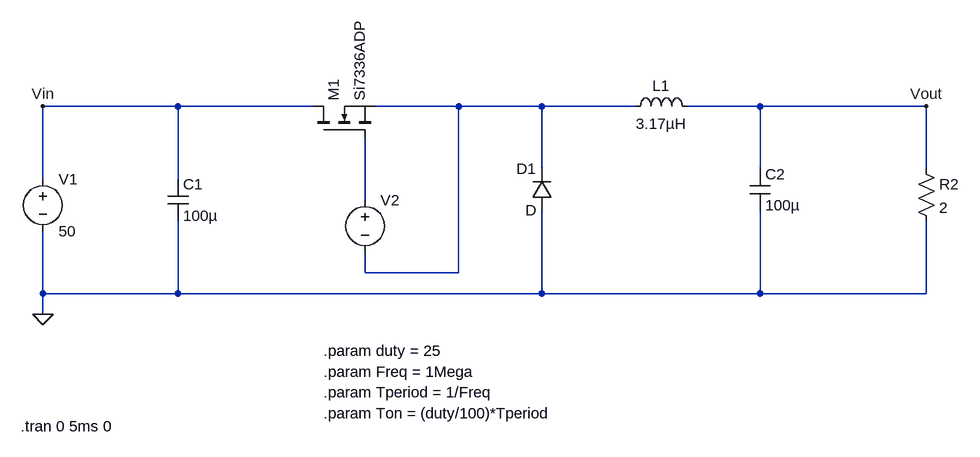
[diagram p0: schematic buck.asc]
buck.asc, the LTspice schematic file:
Version 4
SHEET 1 1432 680
WIRE -160 64 -368 64
WIRE 48 64 -160 64
WIRE 272 64 144 64
WIRE 400 64 272 64
WIRE 544 64 400 64
WIRE 736 64 624 64
WIRE 992 64 736 64
WIRE 400 160 400 64
WIRE 736 160 736 64
WIRE 992 160 992 64
WIRE -368 176 -368 64
WIRE -160 176 -160 64
WIRE 128 208 128 112
WIRE 128 320 128 288
WIRE 272 320 272 64
WIRE 272 320 128 320
WIRE -368 352 -368 256
WIRE -160 352 -160 240
WIRE -160 352 -368 352
WIRE 400 352 400 224
WIRE 400 352 -160 352
WIRE 736 352 736 224
WIRE 736 352 400 352
WIRE 992 352 992 240
WIRE 992 352 736 352
WIRE -368 384 -368 352
FLAG -368 384 0
FLAG 992 64 Vout
FLAG -368 64 Vin
SYMBOL voltage -368 160 R0
SYMATTR InstName V1
SYMATTR Value 50
SYMBOL cap -176 176 R0
SYMATTR InstName C1
SYMATTR Value 100µ
SYMBOL nmos 48 112 R270
SYMATTR InstName M1
SYMATTR Value Si7336ADP
SYMBOL voltage 128 192 R0
WINDOW 3 24 96 Invisible 2
WINDOW 123 0 0 Left 0
WINDOW 39 0 0 Left 0
SYMATTR InstName V2
SYMATTR Value PULSE(0 5 0 0 0 {Ton} {Tperiod})
SYMBOL ind 528 80 R270
WINDOW 0 32 56 VTop 2
WINDOW 3 5 56 VBottom 2
SYMATTR InstName L1
SYMATTR Value 3.17µH
SYMBOL cap 720 160 R0
SYMATTR InstName C2
SYMATTR Value 100µ
SYMBOL res 976 144 R0
SYMATTR InstName R2
SYMATTR Value 2
SYMBOL diode 416 224 R180
WINDOW 0 24 64 Left 2
WINDOW 3 24 0 Left 2
SYMATTR InstName D1
TEXT 64 536 Left 2 !.param Ton = (duty/100)*Tperiod
TEXT 64 504 Left 2 !.param Tperiod = 1/Freq
TEXT 64 472 Left 2 !.param Freq = 1Mega
TEXT 64 440 Left 2 !.param duty = 25
TEXT -402 556 Left 2 !.tran 0 5ms 0

The netlist it stands for:
* buck.asc
V1 Vin 0 50
C1 Vin 0 100µ
M1 Vin N002 N001 N001 Si7336ADP
V2 N002 N001 PULSE(0 5 0 0 0 {Ton} {Tperiod})
L1 N001 Vout 3.17µH
C2 Vout 0 100µ
R2 Vout 0 2
D1 0 N001 D
.model D D
.lib standard.dio
.model NMOS NMOS
.model PMOS PMOS
.lib standard.mos
.param Ton = (duty/100)*Tperiod
.param Tperiod = 1/Freq
.param Freq = 1Mega
.param duty = 25
.tran 0 5ms 0
.backanno
.end